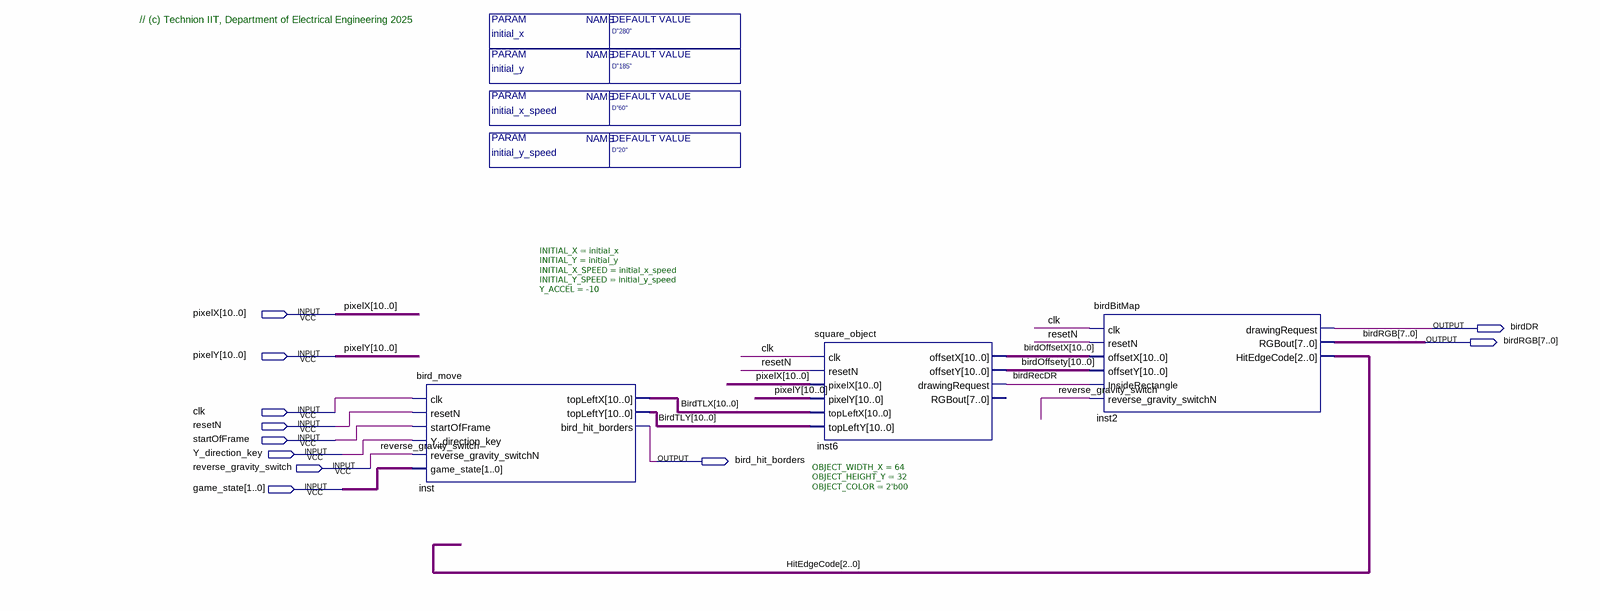
[diagram p0: schematic sheet]
// Quartus schematic Bird_Block_T.bdf as structural Verilog: 3 symbols, 11 pins
module Bird_Block_T #(parameter initial_x = "D\"280\"", parameter initial_y = "D\"185\"", parameter initial_x_speed = "D\"60\"", parameter initial_y_speed = "D\"20\"") (
  input  [10:0] pixelX,
  input  [10:0] pixelY,
  input  clk,
  input  resetN,
  input  startOfFrame,
  input  Y_direction_key,
  input  reverse_gravity_switch,
  input  [1:0] game_state,
  output birdDR,
  output [7:0] birdRGB,
  output bird_hit_borders
);

  wire birdRecDR;
  wire [2:0] HitEdgeCode;
  wire [10:0] birdOffsetX, birdOffsety, BirdTLX, BirdTLY;

  bird_move #(.INITIAL_X(initial_x), .INITIAL_Y(initial_y), .INITIAL_X_SPEED(initial_x_speed), .INITIAL_Y_SPEED(initial_y_speed), .Y_ACCEL(-10)) inst (
    .clk(clk), .resetN(resetN), .startOfFrame(startOfFrame), .Y_direction_key(Y_direction_key),
    .reverse_gravity_switchN(reverse_gravity_switch), .game_state(game_state), .topLeftX(BirdTLX),
    .topLeftY(BirdTLY), .bird_hit_borders(bird_hit_borders));
  square_object #(.OBJECT_WIDTH_X(64), .OBJECT_HEIGHT_Y(32), .OBJECT_COLOR(2'b00)) inst6 (
    .clk(clk), .resetN(resetN), .pixelX(pixelX), .pixelY(pixelY), .topLeftX(BirdTLX), .topLeftY(BirdTLY),
    .offsetX(birdOffsetX), .offsetY(birdOffsety), .drawingRequest(birdRecDR));  // open: RGBout
  birdBitMap inst2 (
    .clk(clk), .resetN(resetN), .offsetX(birdOffsetX), .offsetY(birdOffsety), .InsideRectangle(birdRecDR),
    .reverse_gravity_switchN(reverse_gravity_switch), .drawingRequest(birdDR), .RGBout(birdRGB),
    .HitEdgeCode(HitEdgeCode));

  // Notes on the sheet:
  //   // (c) Technion IIT, Department of Electrical Engineering 2025
endmodule
